# EAGLE schematic TemperatureModule (EAGLE 7.6.0)
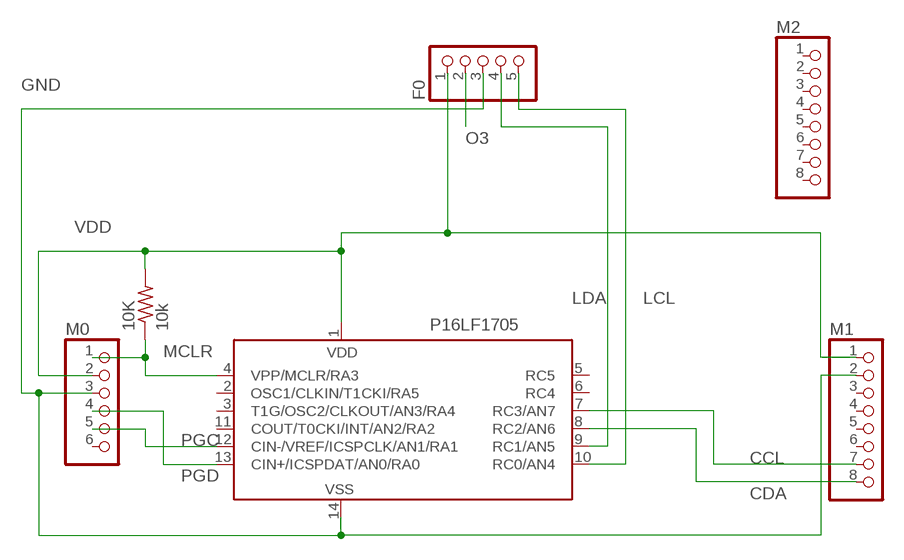
[diagram p0: schematic, sheet 1]

## Parts
10K  10k  R-US_0204/7  [0204/7]
F0  PINHD-1X5  [1X05]
M0  PINHD-1X6  [1X06]
M1  PINHD-1X8  [1X08]
M2  PINHD-1X8  [1X08]
P16LF1705  PIC16F676SL  [SO-14]

## Nets
CCL: M1.7 P16LF1705.7(RC3/AN7)
CDA: M1.8 P16LF1705.8(RC2/AN6)
GND: F0.3 M0.3 M1.2 P16LF1705.14(VSS)
LCL: F0.5 P16LF1705.10(RC0/AN4)
LDA: F0.4 P16LF1705.9(RC1/AN5)
MCLR: 10K.1 M0.1 P16LF1705.4(VPP/MCLR/RA3)
O3: F0.2
PGC: M0.5 P16LF1705.12(CIN-/VREF/ICSPCLK/AN1/RA1)
PGD: M0.4 P16LF1705.13(CIN+/ICSPDAT/AN0/RA0)
VDD: 10K.2 F0.1 M0.2 M1.1 P16LF1705.1(VDD)
Unconnected: M0.6 M1.3 M1.4 M1.5 M1.6 M2.1 M2.2 M2.3 M2.4 M2.5 M2.6 M2.7 M2.8 P16LF1705.2(OSC1/CLKIN/T1CKI/RA5) P16LF1705.3(T1G/OSC2/CLKOUT/AN3/RA4) P16LF1705.5(RC5) P16LF1705.6(RC4) P16LF1705.11(COUT/T0CKI/INT/AN2/RA2)

## Library data of the parts
10K = adafruit:R-US_: RESISTOR, American symbol
F0 = pinhead:PINHD-1X5: PIN HEADER
M0 = pinhead:PINHD-1X6: PIN HEADER
M1 M2 = pinhead:PINHD-1X8: PIN HEADER
P16LF1705 = microchip:PIC16F676: 14-Pin, Flash-Based 8-Bit CMOS Microcontroller High Performance RISC CPU: * Only 35 instructions to learn - All single-cycle instructions except branches * Operating speed: - DC - 20 MHz oscillator/clock input - DC - 200 ns instruction cycle * Internal and external oscillator options - Precision Internal 4 MHz oscillator factory calibrated to ±1% - External Oscillator support for crystals and resonators - 5?s wake-up from SLEEP, 3.0V, typical * Power saving SLEEP mode * Wide operating voltage range - 2.0V to 5.5V * Industrial and Extended temperature range * Low power Power-on Reset (POR) * Power-up Timer (PWRT) and Oscillator Start-up Timer (OST) * Brown-out Detect (BOD) * Watchdog Timer (WDT) with independent oscillator for reliable operation * Multiplexed MCLR/Input-pin * Interrupt-on-pin change * Individual programmable weak pull-ups * Programmable code protection * High Endurance FLASH/EEPROM Cell - 100,000 write FLASH endurance - 1,000,000 write EEPROM endurance - FLASH/Data EEPROM Retention: > 40 years * Standby Current: - 1 nA @ 2.0V, typical * Operating Current: - 8.5?A @ 32 kHz, 2.0V, typical - 100?A @ 1 MHz, 2.0V, typical * Watchdog Timer Current - 300 nA @ 2.0V, typical * Timer1 oscillator current: - 4?A @ 32 kHz, 2.0V, typical * 12 I/O pins with individual direction control * High current sink/source for direct LED drive * Analog-to-Digital Converter module (PIC16F676): - 10-bit resolution - Programmable 8-channel input - Voltage reference input * In-Circuit Serial ProgrammingTM (ICSPTM) via two pins Source: http://ww1.microchip.com/downloads/en/DeviceDoc/40039E.pdf; MF: MICROCHIP; MPN: PIC16F676-I/SL; OC_FARNELL: 9760520; OC_NEWARK: 92C4557

## Net classes
0 default: width 0.305 mm, drill 0.61 mm, clearance 0.254 mm